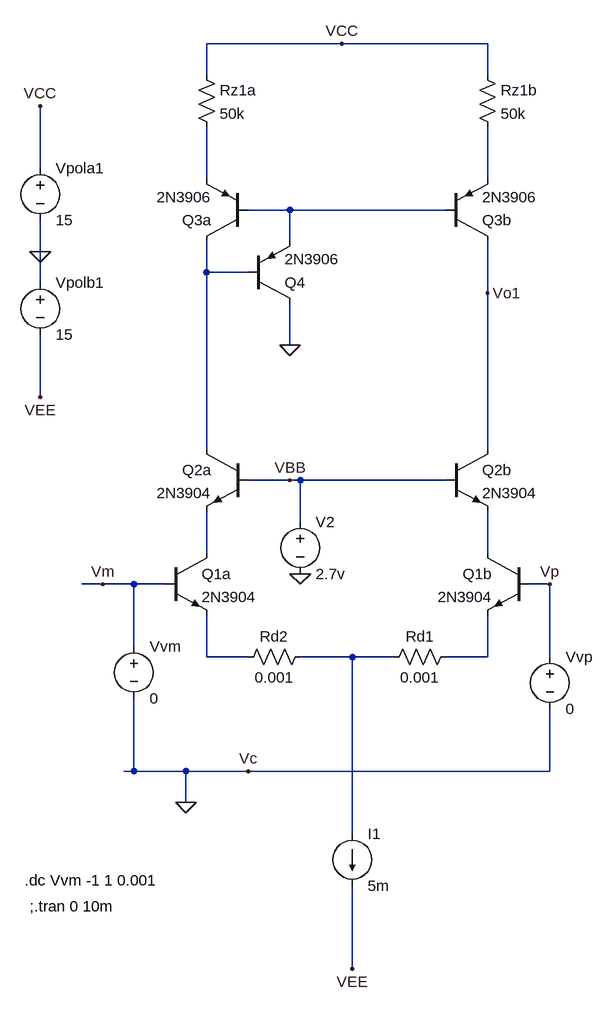
[diagram p0: schematic Etage1.asc]
Etage1.asc, the LTspice schematic file:
Version 4
SHEET 1 1612 1016
WIRE 512 -512 304 -512
WIRE 736 -512 512 -512
WIRE 304 -464 304 -512
WIRE 736 -464 736 -512
WIRE 48 -320 48 -416
WIRE 304 -304 304 -384
WIRE 736 -304 736 -384
WIRE 432 -256 368 -256
WIRE 672 -256 432 -256
WIRE 432 -208 432 -256
WIRE 48 -192 48 -240
WIRE 304 -160 304 -208
WIRE 368 -160 304 -160
WIRE 48 -144 48 -192
WIRE 736 -128 736 -208
WIRE 432 -48 432 -112
WIRE 48 32 48 -64
WIRE 304 112 304 -160
WIRE 736 112 736 -128
WIRE 432 160 368 160
WIRE 448 160 432 160
WIRE 672 160 448 160
WIRE 448 224 448 160
WIRE 304 272 304 208
WIRE 736 272 736 208
WIRE 144 320 112 320
WIRE 192 320 144 320
WIRE 240 320 192 320
WIRE 832 320 800 320
WIRE 192 416 192 320
WIRE 304 432 304 368
WIRE 368 432 304 432
WIRE 528 432 448 432
WIRE 592 432 528 432
WIRE 736 432 736 368
WIRE 736 432 672 432
WIRE 832 432 832 320
WIRE 192 608 192 496
WIRE 192 608 176 608
WIRE 272 608 192 608
WIRE 368 608 272 608
WIRE 832 608 832 512
WIRE 832 608 368 608
WIRE 272 656 272 608
WIRE 528 704 528 432
WIRE 528 912 528 784
FLAG 512 -512 VCC
FLAG 48 -416 VCC
FLAG 48 32 VEE
FLAG 48 -192 0
FLAG 432 160 VBB
FLAG 736 -128 Vo1
FLAG 832 320 Vp
FLAG 144 320 Vm
FLAG 432 -48 0
FLAG 368 608 Vc
FLAG 272 656 0
FLAG 528 912 VEE
FLAG 448 304 0
SYMBOL npn 240 272 R0
SYMATTR InstName Q1a
SYMATTR Value 2N3904
SYMBOL npn 800 272 M0
SYMATTR InstName Q1b
SYMATTR Value 2N3904
SYMBOL npn 672 112 R0
SYMATTR InstName Q2b
SYMATTR Value 2N3904
SYMBOL npn 368 112 M0
SYMATTR InstName Q2a
SYMATTR Value 2N3904
SYMBOL pnp 368 -208 R180
SYMATTR InstName Q3a
SYMATTR Value 2N3906
SYMBOL pnp 368 -112 M180
SYMATTR InstName Q4
SYMATTR Value 2N3906
SYMBOL pnp 672 -208 M180
SYMATTR InstName Q3b
SYMATTR Value 2N3906
SYMBOL res 288 -480 R0
SYMATTR InstName Rz1a
SYMATTR Value 50k
SYMBOL res 720 -480 R0
SYMATTR InstName Rz1b
SYMATTR Value 50k
SYMBOL voltage 48 -336 R0
WINDOW 123 0 0 Left 0
WINDOW 39 0 0 Left 0
SYMATTR InstName Vpola1
SYMATTR Value 15
SYMBOL voltage 48 -160 R0
WINDOW 123 0 0 Left 0
WINDOW 39 0 0 Left 0
SYMATTR InstName Vpolb1
SYMATTR Value 15
SYMBOL res 688 416 R90
WINDOW 0 0 56 VBottom 2
WINDOW 3 32 56 VTop 2
SYMATTR InstName Rd1
SYMATTR Value 0.001
SYMBOL res 464 416 R90
WINDOW 0 0 56 VBottom 2
WINDOW 3 32 56 VTop 2
SYMATTR InstName Rd2
SYMATTR Value 0.001
SYMBOL current 528 704 R0
WINDOW 123 0 0 Left 0
WINDOW 39 0 0 Left 0
SYMATTR InstName I1
SYMATTR Value 5m
SYMBOL voltage 448 208 R0
WINDOW 123 0 0 Left 0
WINDOW 39 0 0 Left 0
SYMATTR InstName V2
SYMATTR Value 2.7v
SYMBOL Voltage 832 416 R0
SYMATTR InstName Vvp
SYMATTR Value 0
SYMBOL Voltage 192 400 R0
SYMATTR InstName Vvm
SYMATTR Value 0
TEXT 32 816 Left 2 !;.tran 0 10m
TEXT 24 776 Left 2 !.dc Vvm -1 1 0.001

The netlist it stands for:
* Etage1.asc
Q1a N005 Vm N007 0 2N3904
Q1b N006 Vp N009 0 2N3904
Q2b Vo1 VBB N006 0 2N3904
Q2a N004 VBB N005 0 2N3904
Q3a N004 N003 N001 0 2N3906
Q4 0 N004 N003 0 2N3906
Q3b Vo1 N003 N002 0 2N3906
Rz1a VCC N001 50k
Rz1b VCC N002 50k
Vpola1 VCC 0 15
Vpolb1 0 VEE 15
Rd1 N009 N008 0.001
Rd2 N008 N007 0.001
I1 N008 VEE 5m
V2 VBB 0 2.7v
Vvp Vp 0 0
Vvm Vm 0 0
.model NPN NPN
.model PNP PNP
.lib standard.bjt
;.tran 0 10m
.dc Vvm -1 1 0.001
.backanno
.end

* Results of the author's LTspice run, read from the files saved beside the schematic
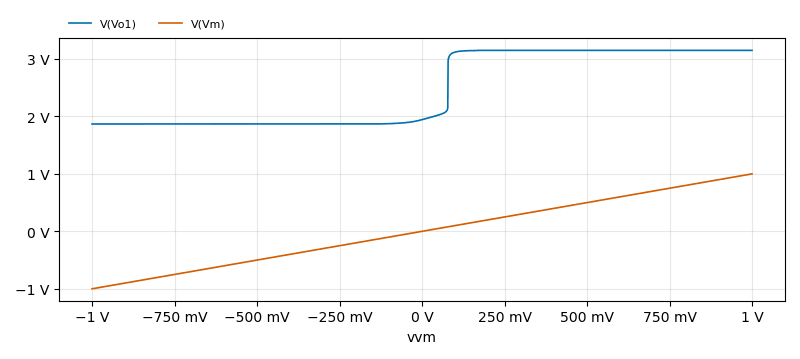
[diagram p1: DC transfer characteristic of Etage1.asc, plotted from the saved traces]
* DC transfer characteristic, 1 run:
*   V(Vo1): 1.868 V at vvm=-1 V, 3.15 V at vvm=1 V, min 1.868 V, max 3.15 V
*   V(Vm): -1 V at vvm=-1 V, 1 V at vvm=1 V, min -1 V, max 1 V